# Altium project 水下机器人电调控制板2020.PrjPcb
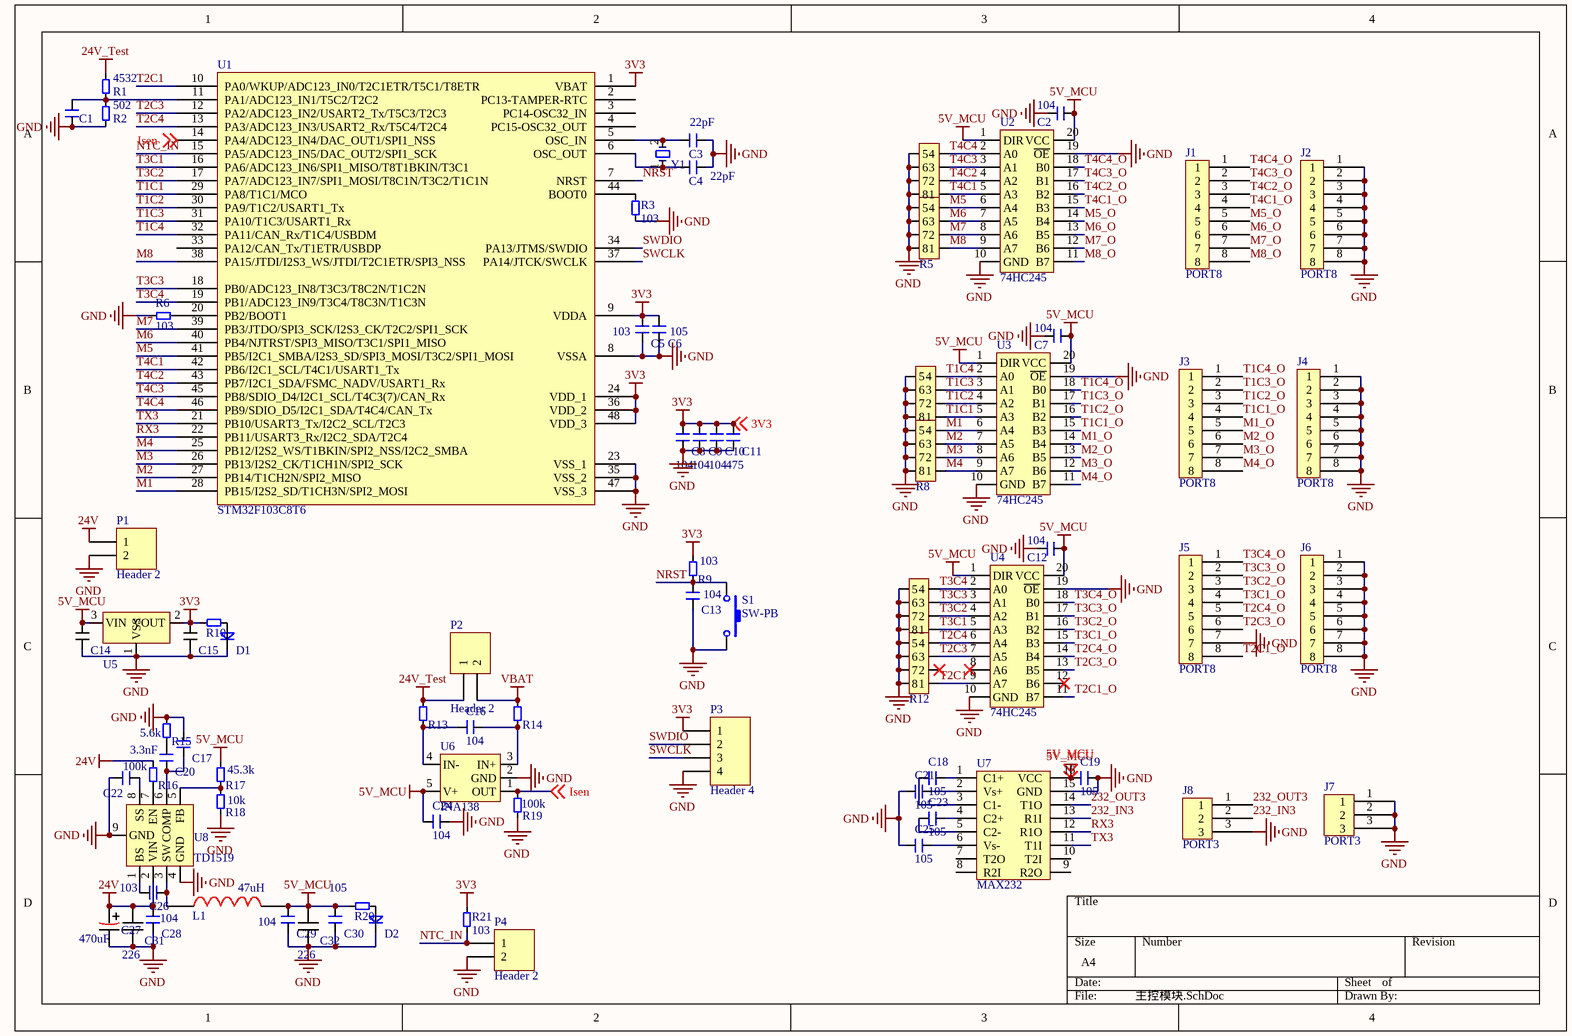
[diagram p0: 主控模块.SchDoc]
1 sheet, 78 parts. Net scope: global (net labels, ports and power ports of the same name join across sheets).
Board file: 水下机器人电调控制板2020.PcbDoc

## Sheet 主控模块.SchDoc
size A4

### Parts
C1  0603C  [0603C]  (value not drawn)
C2  Parameter 1: 104  [0603C]  (hidden comment: 0603C)
C3  Parameter 1: 22pF  [0603C]  (hidden comment: 0603C)
C4  Parameter 1: 22pF  [0603C]  (hidden comment: 0603C)
C5  Parameter 1: 103  [0603C]  (hidden comment: 0603C)
C6  Parameter 1: 105  [0603C]  (hidden comment: 0603C)
C7  Parameter 1: 104  [0603C]  (hidden comment: 0603C)
C8  Parameter 1: 104  [0603C]  (hidden comment: 0603C)
C9  Parameter 1: 104  [0603C]  (hidden comment: 0603C)
C10  Parameter 1: 104  [0603C]  (hidden comment: 0603C)
C11  Parameter 1: 475  [0603C]  (hidden comment: 0603C)
C12  Parameter 1: 104  [0603C]  (hidden comment: 0603C)
C13  Parameter 1: 104  [0603C]  (hidden comment: 0603C)
C14  0805C  [0805C]  (value not drawn)
C15  0805C  [0805C]  (value not drawn)
C16  Parameter 1: 104  [0603C]  (hidden comment: 0603C)
C17  0603C  [0603C]  (value not drawn)
C18  Parameter 1: 105  [0603C]  (hidden comment: 0603C)
C19  Parameter 1: 105  [0603C]  (hidden comment: 0603C)
C20  Parameter 1: 3.3nF  [0603C]  (hidden comment: 0603C)
C21  Parameter 1: 105  [0603C]  (hidden comment: 0603C)
C22  0603C  [0603C]  (value not drawn)
C23  Parameter 1: 105  [0603C]  (hidden comment: 0603C)
C24  Parameter 1: 104  [0603C]  (hidden comment: 0603C)
C25  Parameter 1: 105  [0603C]  (hidden comment: 0603C)
C26  Parameter 1: 103  [0603C]  (hidden comment: 0603C)
C27  Parameter 1: 470uF  [CAP-10*10.2]  (hidden comment: 10*10贴片电解电容)
C28  Parameter 1: 104  [0603C]  (hidden comment: 0603C)
C29  Parameter 1: 104  [0603C]  (hidden comment: 0603C)
C30  Parameter 1: 105  [0603C]  (hidden comment: 0603C)
C31  Parameter 1: 226  [1206C]  (hidden comment: 1206C)
C32  Parameter 1: 226  [固态电容5*9]  (hidden comment: 1206C)
D1  0603D  [0603D]  (value not drawn)
D2  0603D  [0603D]  (value not drawn)
J1  PORT8  [PORT8]
J2  PORT8  [PORT8]
J3  PORT8  [PORT8]
J4  PORT8  [PORT8]
J5  PORT8  [PORT8]
J6  PORT8  [PORT8]
J7  PORT3  [PORT3]
J8  PORT3  [PORT3]
L1  Parameter 1: 47uH  [1265L]  (hidden comment: 1265L)
P1  Header 2  [DB129-2]
P2  Header 2  [HDR1X2]
P3  Header 4  [HDR1X4]
P4  Header 2  [HDR1X2]
R1  4532  [0603R]
R2  502  [0603R]
R3  Parameter 1: 103  [0603R]  (hidden comment: 0603R)
R4  排阻  [0603RA]  (value not drawn)
R5  排阻  [0603RA]  (value not drawn)
R6  Parameter 1: 103  [0603R]  (hidden comment: 0603R)
R7  排阻  [0603RA]  (value not drawn)
R8  排阻  [0603RA]  (value not drawn)
R9  Parameter 1: 103  [0603R]  (hidden comment: 0603R)
R10  0603R  [0603R]  (value not drawn)
R11  排阻  [0603RA]  (value not drawn)
R12  排阻  [0603RA]  (value not drawn)
R13  0603R  [0603R]  (value not drawn)
R14  0603R  [0603R]  (value not drawn)
R15  Parameter 1: 5.6k  [0603R]  (hidden comment: 0603R)
R16  Parameter 1: 100k  [0603R]  (hidden comment: 0603R)
R17  Parameter 1: 45.3k  [0603R]  (hidden comment: 0603R)
R18  Parameter 1: 10k  [0603R]  (hidden comment: 0603R)
R19  Parameter 1: 100k  [0603R]  (hidden comment: 0603R)
R20  0603R  [0603R]  (value not drawn)
R21  Parameter 1: 103  [0603R]  (hidden comment: 0603R)
S1  SW-PB  [按键 3x6]
U1  STM32F103C8T6  [QFP48]
U2  74HC245  [TSSOP20-OR65-4R40]
U3  74HC245  [TSSOP20-OR65-4R40]
U4  74HC245  [TSSOP20-OR65-4R40]
U5  662k  [SOT23-3]  (value not drawn)
U6  INA138  [SOT23-5]
U7  MAX232  [SOP16]
U8  TD1519  [SOP8-PAD]
Y1  XTAL_5032  [XTAL贴片]  (value not drawn)

### Nets
3V3: C5.2 C6.2 C8.1 C9.1 C10.1 C11.1 C15.2 P3.1 R9.2 R10.1 R21.2 U1.1(VBAT) U1.9(VDDA) U1.24(VDD_1) U1.36(VDD_2) U1.48(VDD_3) U5.2(VOUT) ; off-sheet 3V3
5V_MCU: C2.2 C7.2 C12.2 C14.2 C19.1 C24.2 C29.2 C30.2 C32.2 L1.2 R17.2 R20.1 U2.1(DIR) U2.20(VCC) U3.1(DIR) U3.20(VCC) U4.1(DIR) U4.20(VCC) U5.3(VIN) U6.5(V+) U7.16(VCC) ; off-sheet 5V_MCU
24V: C27.1 C28.2 C31.1 P1.1 R16.2 U8.2(VIN)
24V_Test: P2.1 R1.1 R13.2
GND: C1.1 C2.1 C3.2 C4.2 C5.1 C6.1 C7.1 C8.2 C9.2 C10.2 C11.2 C12.1 C13.1 C14.1 C15.1 C17.1 C19.2 C21.1 C22.2 C24.1 C25.1 C27.2 C28.1 C29.1 C30.1 C31.2 C32.1 D1.2 D2.2 J2.1 J2.2 J2.3 J2.4 J2.5 J2.6 J2.7 J2.8 J4.1 J4.2 J4.3 J4.4 J4.5 J4.6 J4.7 J4.8 J5.7 J6.1 J6.2 J6.3 J6.4 J6.5 J6.6 J6.7 J6.8 J7.1 J7.2 J7.3 J8.3 P1.2 P3.4 P4.2 R2.2 R3.1 R4.5 R4.6 R4.7 R4.8 R5.5 R5.6 R5.7 R5.8 R6.1 R7.5 R7.6 R7.7 R7.8 R8.5 R8.6 R8.7 R8.8 R11.5 R11.6 R11.7 R11.8 R12.5 R12.6 R12.7 R12.8 R15.2 R18.1 R19.1 S1.2 U1.8(VSSA) U1.23(VSS_1) U1.35(VSS_2) U1.47(VSS_3) U2.10(GND) U2.19(~{OE}) U3.10(GND) U3.19(~{OE}) U4.10(GND) U4.19(~{OE}) U5.1(VSS) U6.2(GND) U7.15(GND) U8.4(GND) U8.9(GND)
VBAT: P2.2 R14.2
232_IN3: J8.2 U7.13(R1I)
232_OUT3: J8.1 U7.14(T1O)
Isen: R19.2 U1.14(PA4/ADC123_IN4/DAC_OUT1/SPI1_NSS) U6.1(OUT) ; off-sheet Isen
M1: R8.4 U1.28(PB15/I2S2_SD/T1CH3N/SPI2_MOSI) U3.6(A4)
M1_O: J3.5 U3.14(B4)
M2: R8.3 U1.27(PB14/T1CH2N/SPI2_MISO) U3.7(A5)
M2_O: J3.6 U3.13(B5)
M3: R8.2 U1.26(PB13/I2S2_CK/T1CH1N/SPI2_SCK) U3.8(A6)
M3_O: J3.7 U3.12(B6)
M4: R8.1 U1.25(PB12/I2S2_WS/T1BKIN/SPI2_NSS/I2C2_SMBA) U3.9(A7)
M4_O: J3.8 U3.11(B7)
M5: R5.4 U1.41(PB5/I2C1_SMBA/I2S3_SD/SPI3_MOSI/T3C2/SPI1_MOSI) U2.6(A4)
M5_O: J1.5 U2.14(B4)
M6: R5.3 U1.40(PB4/NJTRST/SPI3_MISO/T3C1/SPI1_MISO) U2.7(A5)
M6_O: J1.6 U2.13(B5)
M7: R5.2 U1.39(PB3/JTDO/SPI3_SCK/I2S3_CK/T2C2/SPI1_SCK) U2.8(A6)
M7_O: J1.7 U2.12(B6)
M8: R5.1 U1.38(PA15/JTDI/I2S3_WS/JTDI/T2C1ETR/SPI3_NSS) U2.9(A7)
M8_O: J1.8 U2.11(B7)
NRST: C13.2 R9.1 S1.1 U1.7(NRST)
NTC_IN: P4.1 R21.1 U1.15(PA5/ADC123_IN5/DAC_OUT2/SPI1_SCK)
RX3: U1.22(PB11/USART3_Rx/I2C2_SDA/T2C4) U7.12(R1O)
SWCLK: P3.3 U1.37(PA14/JTCK/SWCLK)
SWDIO: P3.2 U1.34(PA13/JTMS/SWDIO)
T1C1: R7.1 U1.29(PA8/T1C1/MCO) U3.5(A3)
T1C1_O: J3.4 U3.15(B3)
T1C2: R7.2 U1.30(PA9/T1C2/USART1_Tx) U3.4(A2)
T1C2_O: J3.3 U3.16(B2)
T1C3: R7.3 U1.31(PA10/T1C3/USART1_Rx) U3.3(A1)
T1C3_O: J3.2 U3.17(B1)
T1C4: R7.4 U1.32(PA11/CAN_Rx/T1C4/USBDM) U3.2(A0)
T1C4_O: J3.1 U3.18(B0)
T2C1: R12.1 U1.10(PA0/WKUP/ADC123_IN0/T2C1ETR/T5C1/T8ETR) U4.9(A7)
T2C1_O: J5.8 U4.11(B7)
T2C3: R12.3 U1.12(PA2/ADC123_IN2/USART2_Tx/T5C3/T2C3) U4.7(A5)
T2C3_O: J5.6 U4.13(B5)
T2C4: R12.4 U1.13(PA3/ADC123_IN3/USART2_Rx/T5C4/T2C4) U4.6(A4)
T2C4_O: J5.5 U4.14(B4)
T3C1: R11.1 U1.16(PA6/ADC123_IN6/SPI1_MISO/T8T1BKIN/T3C1) U4.5(A3)
T3C1_O: J5.4 U4.15(B3)
T3C2: R11.2 U1.17(PA7/ADC123_IN7/SPI1_MOSI/T8C1N/T3C2/T1C1N) U4.4(A2)
T3C2_O: J5.3 U4.16(B2)
T3C3: R11.3 U1.18(PB0/ADC123_IN8/T3C3/T8C2N/T1C2N) U4.3(A1)
T3C3_O: J5.2 U4.17(B1)
T3C4: R11.4 U1.19(PB1/ADC123_IN9/T3C4/T8C3N/T1C3N) U4.2(A0)
T3C4_O: J5.1 U4.18(B0)
T4C1: R4.1 U1.42(PB6/I2C1_SCL/T4C1/USART1_Tx) U2.5(A3)
T4C1_O: J1.4 U2.15(B3)
T4C2: R4.2 U1.43(PB7/I2C1_SDA/FSMC_NADV/USART1_Rx) U2.4(A2)
T4C2_O: J1.3 U2.16(B2)
T4C3: R4.3 U1.45(PB8/SDIO_D4/I2C1_SCL/T4C3(7)/CAN_Rx) U2.3(A1)
T4C3_O: J1.2 U2.17(B1)
T4C4: R4.4 U1.46(PB9/SDIO_D5/I2C1_SDA/T4C4/CAN_Tx) U2.2(A0)
T4C4_O: J1.1 U2.18(B0)
TX3: U1.21(PB10/USART3_Tx/I2C2_SCL/T2C3) U7.11(T1I)
NetC1_2: C1.2 R1.2 R2.1 U1.11(PA1/ADC123_IN1/T5C2/T2C2)
NetC3_1: C3.1 U1.5(OSC_IN) Y1.2
NetC4_1: C4.1 U1.6(OSC_OUT) Y1.1
NetC16_1: C16.1 R14.1 U6.3(IN+)
NetC16_2: C16.2 R13.1 U6.4(IN-)
NetC17_2: C17.2 C20.2 U8.6(COMP)
NetC18_1: C18.1 U7.3(C1-)
NetC18_2: C18.2 U7.1(C1+)
NetC20_1: C20.1 R15.1
NetC21_2: C21.2 U7.2(Vs+)
NetC22_1: C22.1 U8.8(SS)
NetC23_1: C23.1 U7.5(C2-)
NetC23_2: C23.2 U7.4(C2+)
NetC25_2: C25.2 U7.6(Vs-)
NetC26_1: C26.1 L1.1 U8.3(SW)
NetC26_2: C26.2 U8.1(BS)
NetD1_1: D1.1 R10.2
NetD2_1: D2.1 R20.2
NetR3_2: R3.2 U1.44(BOOT0)
NetR6_2: R6.2 U1.20(PB2/BOOT1)
NetR16_1: R16.1 U8.7(EN)
NetR17_1: R17.1 R18.2 U8.5(FB)

Not connected (* = marked no-connect by the designer): R12 2*; U1 2(PC13-TAMPER-RTC) 3(PC14-OSC32_IN) 4(PC15-OSC32_OUT) 33(PA12/CAN_Tx/T1ETR/USBDP); U4 8(A6)* 12(B6)*; U7 7(T2O) 8(R2I) 9(R2O) 10(T2I)

### Library data of the parts
P1 P2 P4 = Header 2: Header, 2-Pin; LatestRevisionDate: 17-Jul-2002; LatestRevisionNote: Re-released for DXP Platform.; Publisher: Altium Limited
P3 = Header 4: Header, 4-Pin; LatestRevisionDate: 17-Jul-2002; LatestRevisionNote: Re-released for DXP Platform.; Publisher: Altium Limited
R1 R2 = 0603R
S1 = SW-PB: Switch; Published: 24-Mar-1999; LatestRevisionDate: 17-Jul-2002; LatestRevisionNote: Re-released for DXP Platform.; PackageReference: SPST-2; Publisher: Altium Limited; PackageDescription: Switch; 2 Leads